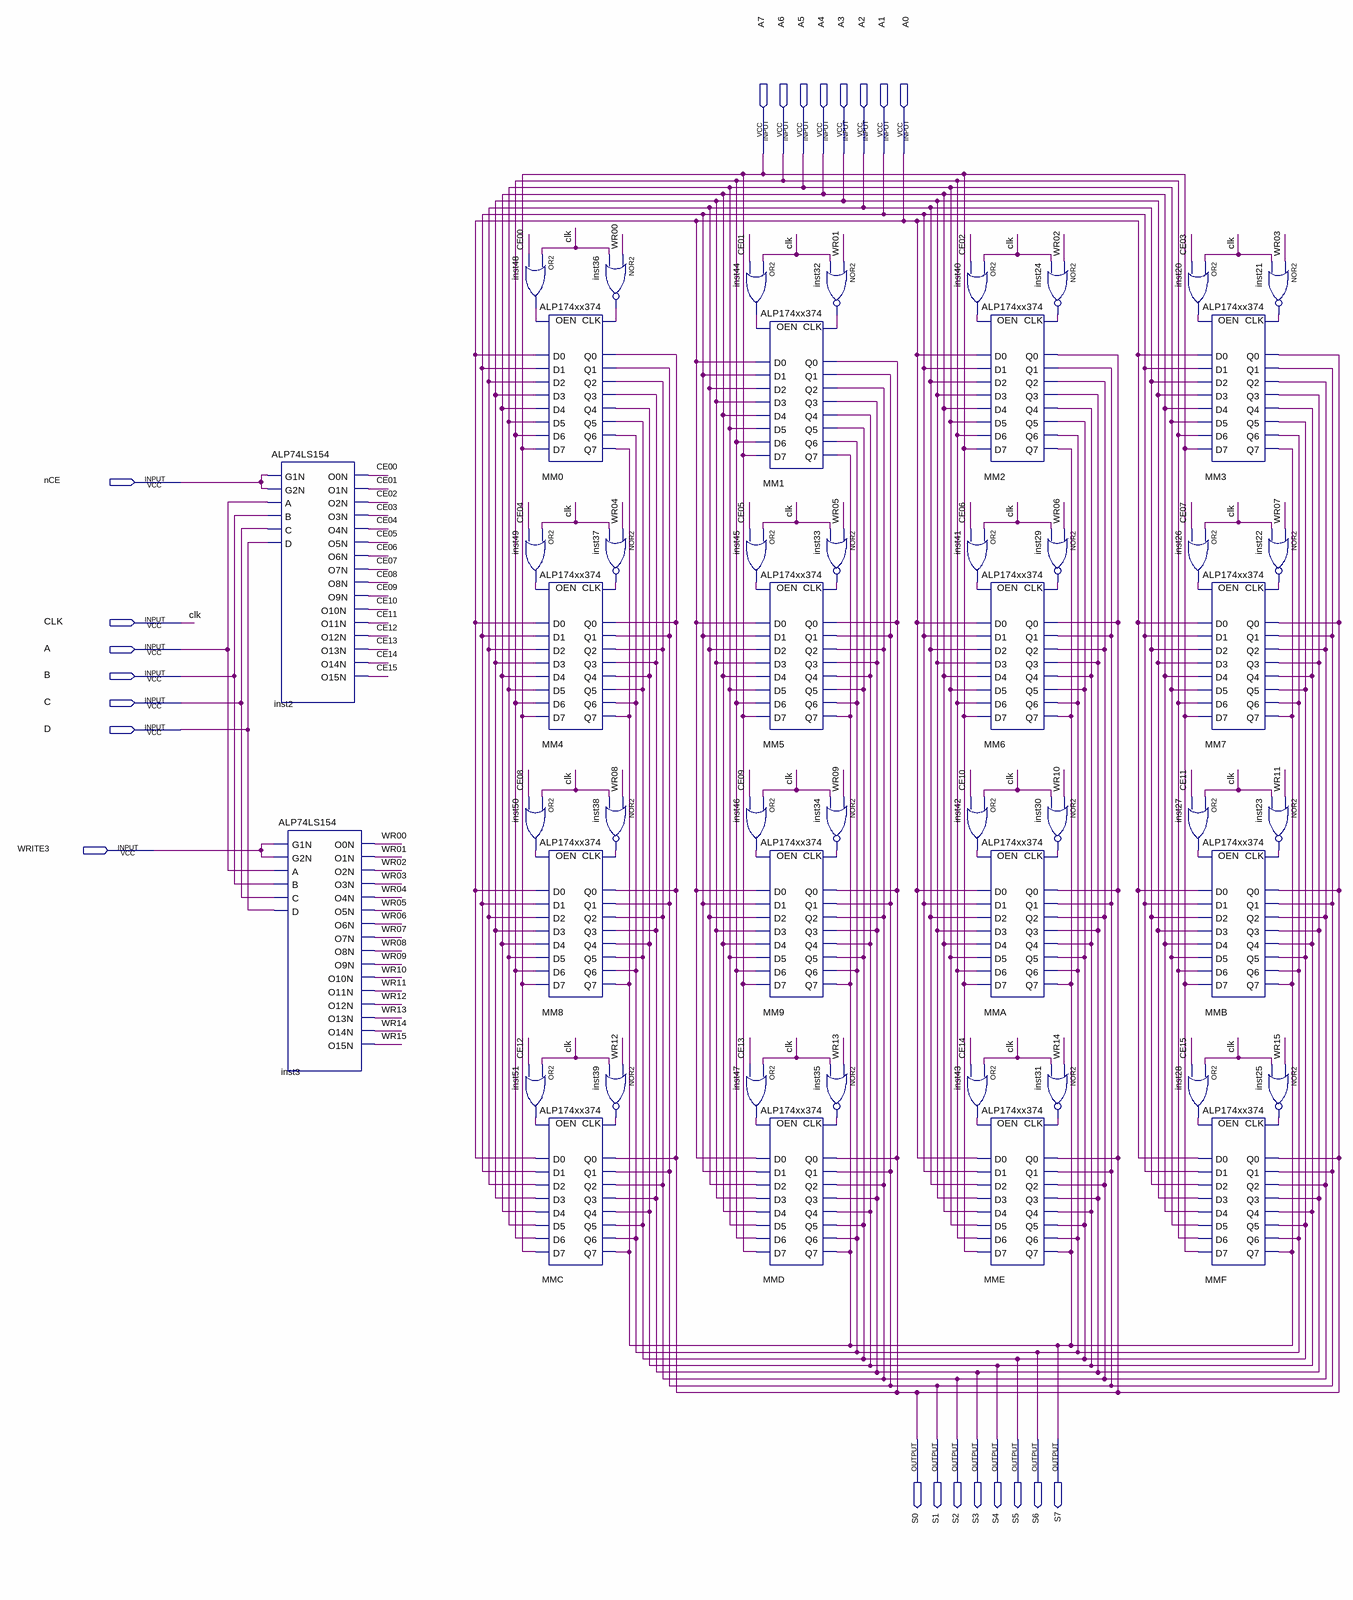
[diagram p0: schematic sheet]
// Quartus schematic ALPRAM16x8.bdf as structural Verilog: 50 symbols, 23 pins
module ALPRAM16x8 (
  input  A7,
  input  A6,
  input  A5,
  input  A4,
  input  A3,
  input  A2,
  input  A1,
  input  A0,
  input  nCE,
  input  CLK,
  input  A,
  input  B,
  input  C,
  input  D,
  input  WRITE3,
  output S0,
  output S1,
  output S2,
  output S3,
  output S4,
  output S5,
  output S6,
  output S7
);

  wire CE00, CE01, CE02, CE03, CE04, CE05, CE06, CE07, CE08, CE09, CE10, CE11, CE12, CE13, CE14, CE15,
       inst20_out, inst21_out, inst22_out, inst23_out, inst24_out, inst25_out, inst26_out, inst27_out,
       inst28_out, inst29_out, inst30_out, inst31_out, inst32_out, inst33_out, inst34_out, inst35_out,
       inst36_out, inst37_out, inst38_out, inst39_out, inst40_out, inst41_out, inst42_out, inst43_out,
       inst44_out, inst45_out, inst46_out, inst47_out, inst48_out, inst49_out, inst50_out, inst51_out, WR00,
       WR01, WR02, WR03, WR04, WR05, WR06, WR07, WR08, WR09, WR10, WR11, WR12, WR13, WR14, WR15;

  ALP74LS154 inst2 (
    .G1N(nCE), .G2N(nCE), .A(A), .B(B), .C(C), .D(D), .O0N(CE00), .O1N(CE01), .O2N(CE02), .O3N(CE03),
    .O4N(CE04), .O5N(CE05), .O6N(CE06), .O7N(CE07), .O8N(CE08), .O9N(CE09), .O10N(CE10), .O11N(CE11),
    .O12N(CE12), .O13N(CE13), .O14N(CE14), .O15N(CE15));
  ALP74LS154 inst3 (
    .G1N(WRITE3), .G2N(WRITE3), .A(A), .B(B), .C(C), .D(D), .O0N(WR00), .O1N(WR01), .O2N(WR02), .O3N(WR03),
    .O4N(WR04), .O5N(WR05), .O6N(WR06), .O7N(WR07), .O8N(WR08), .O9N(WR09), .O10N(WR10), .O11N(WR11),
    .O12N(WR12), .O13N(WR13), .O14N(WR14), .O15N(WR15));
  or inst48 (inst48_out, CLK, CE00);
  ALP174xx374 MM0 (
    .OEN(inst48_out), .CLK(inst36_out), .D0(A0), .D1(A1), .D2(A2), .D3(A3), .D4(A4), .D5(A5), .D6(A6),
    .D7(A7), .Q0(S0), .Q1(S1), .Q2(S2), .Q3(S3), .Q4(S4), .Q5(S5), .Q6(S6), .Q7(S7));
  or inst49 (inst49_out, CLK, CE04);
  ALP174xx374 MM4 (
    .OEN(inst49_out), .CLK(inst37_out), .D0(A0), .D1(A1), .D2(A2), .D3(A3), .D4(A4), .D5(A5), .D6(A6),
    .D7(A7), .Q0(S0), .Q1(S1), .Q2(S2), .Q3(S3), .Q4(S4), .Q5(S5), .Q6(S6), .Q7(S7));
  or inst50 (inst50_out, CLK, CE08);
  ALP174xx374 MM8 (
    .OEN(inst50_out), .CLK(inst38_out), .D0(A0), .D1(A1), .D2(A2), .D3(A3), .D4(A4), .D5(A5), .D6(A6),
    .D7(A7), .Q0(S0), .Q1(S1), .Q2(S2), .Q3(S3), .Q4(S4), .Q5(S5), .Q6(S6), .Q7(S7));
  or inst51 (inst51_out, CLK, CE12);
  ALP174xx374 MMC (
    .OEN(inst51_out), .CLK(inst39_out), .D0(A0), .D1(A1), .D2(A2), .D3(A3), .D4(A4), .D5(A5), .D6(A6),
    .D7(A7), .Q0(S0), .Q1(S1), .Q2(S2), .Q3(S3), .Q4(S4), .Q5(S5), .Q6(S6), .Q7(S7));
  nor inst36 (inst36_out, WR00, CLK);
  nor inst37 (inst37_out, WR04, CLK);
  nor inst38 (inst38_out, WR08, CLK);
  nor inst39 (inst39_out, WR12, CLK);
  or inst44 (inst44_out, CLK, CE01);
  ALP174xx374 MM1 (
    .OEN(inst44_out), .CLK(inst32_out), .D0(A0), .D1(A1), .D2(A2), .D3(A3), .D4(A4), .D5(A5), .D6(A6),
    .D7(A7), .Q0(S0), .Q1(S1), .Q2(S2), .Q3(S3), .Q4(S4), .Q5(S5), .Q6(S6), .Q7(S7));
  or inst45 (inst45_out, CLK, CE05);
  ALP174xx374 MM5 (
    .OEN(inst45_out), .CLK(inst33_out), .D0(A0), .D1(A1), .D2(A2), .D3(A3), .D4(A4), .D5(A5), .D6(A6),
    .D7(A7), .Q0(S0), .Q1(S1), .Q2(S2), .Q3(S3), .Q4(S4), .Q5(S5), .Q6(S6), .Q7(S7));
  or inst46 (inst46_out, CLK, CE09);
  ALP174xx374 MM9 (
    .OEN(inst46_out), .CLK(inst34_out), .D0(A0), .D1(A1), .D2(A2), .D3(A3), .D4(A4), .D5(A5), .D6(A6),
    .D7(A7), .Q0(S0), .Q1(S1), .Q2(S2), .Q3(S3), .Q4(S4), .Q5(S5), .Q6(S6), .Q7(S7));
  or inst47 (inst47_out, CLK, CE13);
  ALP174xx374 MMD (
    .OEN(inst47_out), .CLK(inst35_out), .D0(A0), .D1(A1), .D2(A2), .D3(A3), .D4(A4), .D5(A5), .D6(A6),
    .D7(A7), .Q0(S0), .Q1(S1), .Q2(S2), .Q3(S3), .Q4(S4), .Q5(S5), .Q6(S6), .Q7(S7));
  nor inst32 (inst32_out, WR01, CLK);
  nor inst33 (inst33_out, WR05, CLK);
  nor inst34 (inst34_out, WR09, CLK);
  nor inst35 (inst35_out, WR13, CLK);
  or inst40 (inst40_out, CLK, CE02);
  ALP174xx374 MM2 (
    .OEN(inst40_out), .CLK(inst24_out), .D0(A0), .D1(A1), .D2(A2), .D3(A3), .D4(A4), .D5(A5), .D6(A6),
    .D7(A7), .Q0(S0), .Q1(S1), .Q2(S2), .Q3(S3), .Q4(S4), .Q5(S5), .Q6(S6), .Q7(S7));
  or inst41 (inst41_out, CLK, CE06);
  ALP174xx374 MM6 (
    .OEN(inst41_out), .CLK(inst29_out), .D0(A0), .D1(A1), .D2(A2), .D3(A3), .D4(A4), .D5(A5), .D6(A6),
    .D7(A7), .Q0(S0), .Q1(S1), .Q2(S2), .Q3(S3), .Q4(S4), .Q5(S5), .Q6(S6), .Q7(S7));
  or inst42 (inst42_out, CLK, CE10);
  ALP174xx374 MMA (
    .OEN(inst42_out), .CLK(inst30_out), .D0(A0), .D1(A1), .D2(A2), .D3(A3), .D4(A4), .D5(A5), .D6(A6),
    .D7(A7), .Q0(S0), .Q1(S1), .Q2(S2), .Q3(S3), .Q4(S4), .Q5(S5), .Q6(S6), .Q7(S7));
  or inst43 (inst43_out, CLK, CE14);
  ALP174xx374 MME (
    .OEN(inst43_out), .CLK(inst31_out), .D0(A0), .D1(A1), .D2(A2), .D3(A3), .D4(A4), .D5(A5), .D6(A6),
    .D7(A7), .Q0(S0), .Q1(S1), .Q2(S2), .Q3(S3), .Q4(S4), .Q5(S5), .Q6(S6), .Q7(S7));
  nor inst24 (inst24_out, WR02, CLK);
  nor inst29 (inst29_out, WR06, CLK);
  nor inst30 (inst30_out, WR10, CLK);
  nor inst31 (inst31_out, WR14, CLK);
  or inst20 (inst20_out, CLK, CE03);
  ALP174xx374 MM3 (
    .OEN(inst20_out), .CLK(inst21_out), .D0(A0), .D1(A1), .D2(A2), .D3(A3), .D4(A4), .D5(A5), .D6(A6),
    .D7(A7), .Q0(S0), .Q1(S1), .Q2(S2), .Q3(S3), .Q4(S4), .Q5(S5), .Q6(S6), .Q7(S7));
  or inst26 (inst26_out, CLK, CE07);
  ALP174xx374 MM7 (
    .OEN(inst26_out), .CLK(inst22_out), .D0(A0), .D1(A1), .D2(A2), .D3(A3), .D4(A4), .D5(A5), .D6(A6),
    .D7(A7), .Q0(S0), .Q1(S1), .Q2(S2), .Q3(S3), .Q4(S4), .Q5(S5), .Q6(S6), .Q7(S7));
  or inst27 (inst27_out, CLK, CE11);
  ALP174xx374 MMB (
    .OEN(inst27_out), .CLK(inst23_out), .D0(A0), .D1(A1), .D2(A2), .D3(A3), .D4(A4), .D5(A5), .D6(A6),
    .D7(A7), .Q0(S0), .Q1(S1), .Q2(S2), .Q3(S3), .Q4(S4), .Q5(S5), .Q6(S6), .Q7(S7));
  or inst28 (inst28_out, CLK, CE15);
  ALP174xx374 MMF (
    .OEN(inst28_out), .CLK(inst25_out), .D0(A0), .D1(A1), .D2(A2), .D3(A3), .D4(A4), .D5(A5), .D6(A6),
    .D7(A7), .Q0(S0), .Q1(S1), .Q2(S2), .Q3(S3), .Q4(S4), .Q5(S5), .Q6(S6), .Q7(S7));
  nor inst21 (inst21_out, WR03, CLK);
  nor inst22 (inst22_out, WR07, CLK);
  nor inst23 (inst23_out, WR11, CLK);
  nor inst25 (inst25_out, WR15, CLK);
endmodule
